# EAGLE design DAQ (EAGLE 7.3.0)
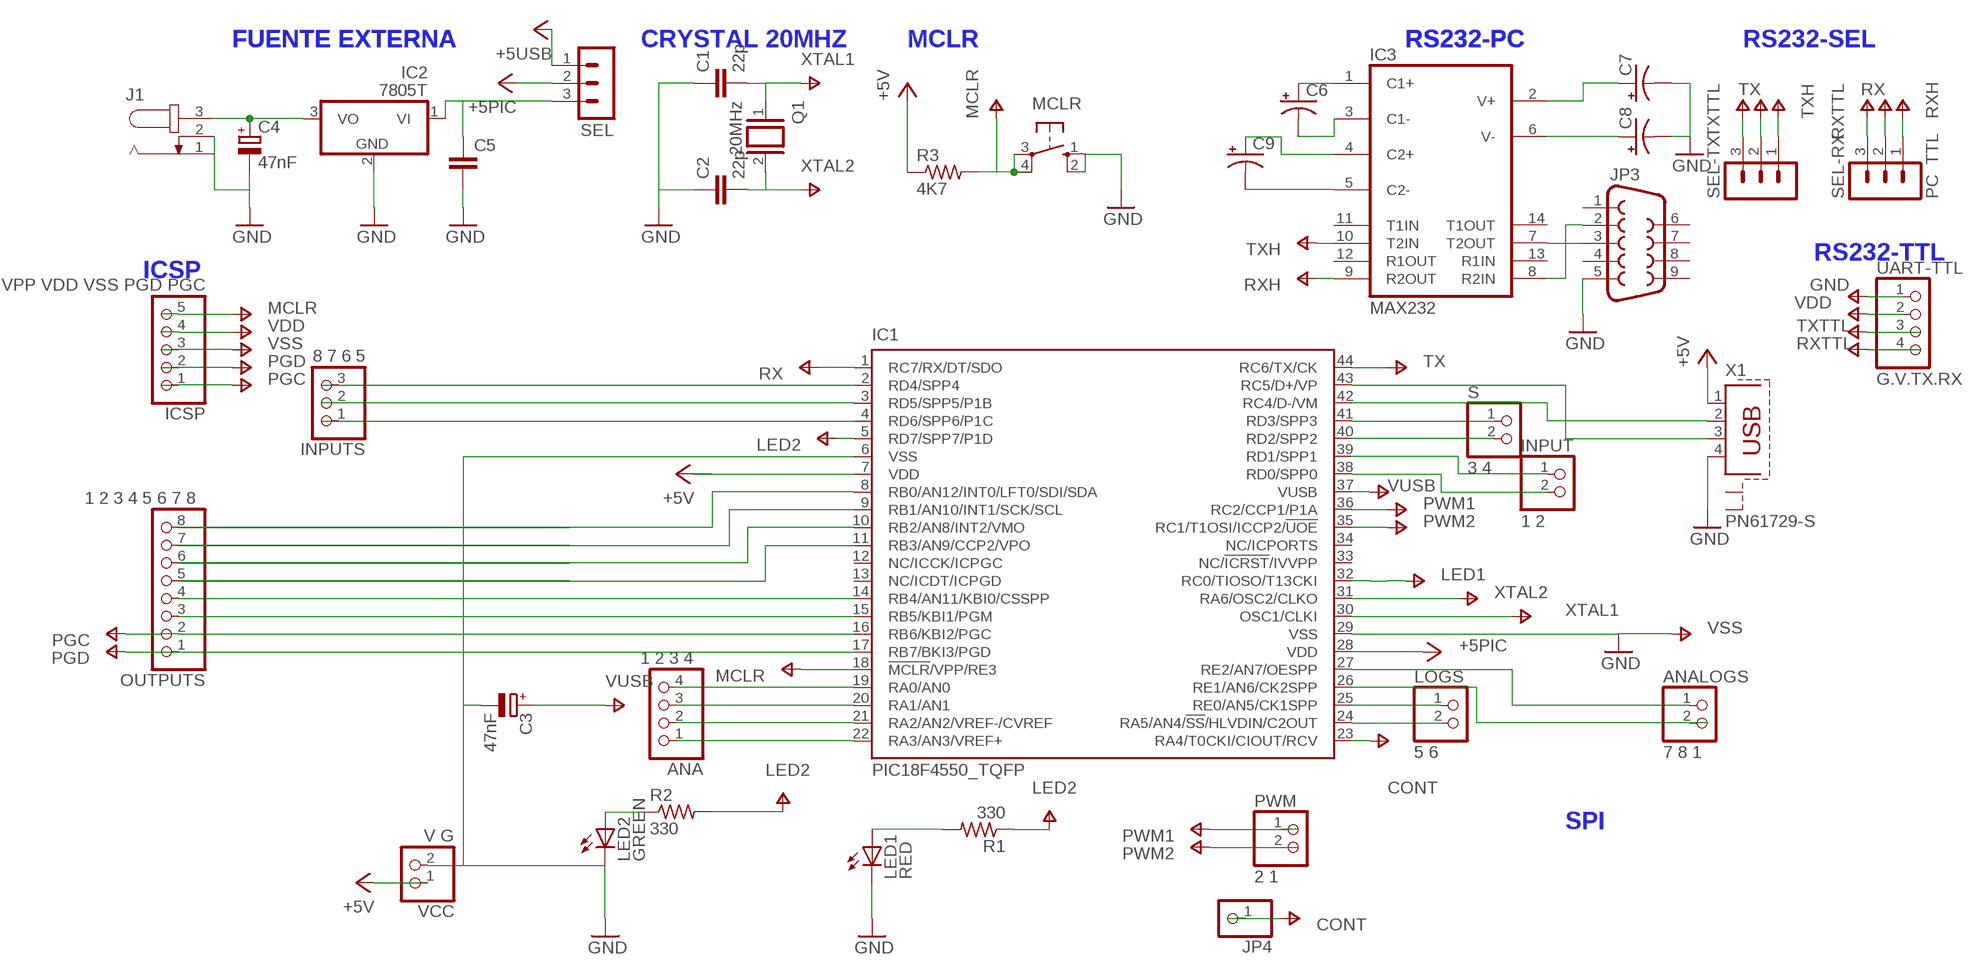
[diagram p0: schematic, sheet 1]

## Parts
ANA  1 2 3 4  PINHD-1X4  [1X04]
ANALOGS  7 8 1  PINHD-1X2  [1X02]
C1  22p  C-EU025-024X044  [C025-024X044]
C2  22p  C-EU025-024X044  [C025-024X044]
C3  47nF  CPOL-EUE2,5-6E  [E2,5-6E]
C4  47nF  CPOL-EUE2,5-6E  [E2,5-6E]
C5  C-EU050-035X075  [C050-035X075]
C6  CPOL-USE2.5-6  [E2,5-6]
C7  CPOL-USE2.5-6  [E2,5-6]
C8  CPOL-USE2.5-6  [E2,5-6]
C9  CPOL-USE2.5-6  [E2,5-6]
IC1  PIC18F4550_TQFP  [TQFP44]
IC2  7805T  [TO220H]
IC3  MAX232  [DIL16]
ICSP  VPP VDD VSS PGD PGC  PINHD-1X5  [1X05]
INPUT  1 2  PINHD-1X2  [1X02]
INPUTS  8 7 6 5  PINHD-1X3  [1X03]
J1  JACK-PLUG0  [SPC4077]
JP3  DB9MALE  [DB9_MALE]
JP4  PINHD-1X1  [1X01]
LED1  RED  TLLR4400  [LED3MM]
LED2  GREEN  TLLG4400  [LED3MM]
LOGS  5 6  PINHD-1X2  [1X02]
MCLR  10-XX  [B3F-10XX]
OUTPUTS  1 2 3 4 5 6 7 8  PINHD-1X8  [1X08]
PWM  2 1  PINHD-1X2  [1X02]
Q1  20MHz  XTAL/S  [QS]
R1  330  R-US_0207/10  [0207/10]
R2  330  R-US_0207/10  [0207/10]
R3  4K7  R-US_0207/10  [0207/10]
S  3 4  PINHD-1X2  [1X02]
SEL  MA03-1  [MA03-1]
SEL-RX  PC TTL  MA03-1  [MA03-1]
SEL-TX  MA03-1  [MA03-1]
UART-TTL  G.V.TX.RX  PINHD-1X4  [1X04]
VCC  V G  PINHD-1X2  [1X02]
X1  PN61729-S  [PN61729-S]

## Nets
+5PIC: IC1.7(VDD) IC1.28(VDD) ICSP.4 R3.1 SEL.2 UART-TTL.2 VCC.1 ; supply symbol labelled +5V, VDD
+5USB: SEL.1 X1.1 ; supply symbol labelled +5V
CONT: IC1.23(RA4/T0CKI/CIOUT/RCV) JP4.1
GND: C1.1 C2.1 C3.- C4.- C5.2 C7.- C8.- IC1.6(VSS) IC1.29(VSS) IC2.2(GND) ICSP.3 J1.1 J1.2 JP3.5 LED1.K(C) LED2.K(C) MCLR.1(S) MCLR.2(S1) UART-TTL.1 VCC.2 X1.4 ; supply symbol labelled VSS
LED1: IC1.32(RC0/TIOSO/T13CKI) R2.2 ; supply symbol labelled LED2
LED2: IC1.5(RD7/SPP7/P1D) R1.1
MCLR: IC1.18(!MCLR!/VPP/RE3) ICSP.5 MCLR.3(P) MCLR.4(P1) R3.2
N$1: IC1.42(RC4/D-/VM) X1.2
N$2: C7.+ IC3.2(V+)
N$3: C8.+ IC3.6(V-)
N$4: IC1.8(RB0/AN12/INT0/LFT0/SDI/SDA) OUTPUTS.8
N$5: LED2.A R2.1
N$6: C6.+ IC3.1(C1+)
N$7: LED1.A R1.2
N$8: C6.- IC3.3(C1-)
N$9: IC1.15(RB5/KBI1/PGM) OUTPUTS.3
N$10: IC1.14(RB4/AN11/KBI0/CSSPP) OUTPUTS.4
N$11: IC1.11(RB3/AN9/CCP2/VPO) OUTPUTS.5
N$12: IC1.9(RB1/AN10/INT1/SCK/SCL) OUTPUTS.7
N$13: IC1.10(RB2/AN8/INT2/VMO) OUTPUTS.6
N$14: C9.+ IC3.4(C2+)
N$15: IC1.43(RC5/D+/VP) X1.3
N$16: IC1.2(RD4/SPP4) INPUTS.3
N$17: IC1.3(RD5/SPP5/P1B) INPUTS.2
N$18: IC1.4(RD6/SPP6/P1C) INPUTS.1
N$19: IC1.38(RD0/SPP0) INPUT.2
N$20: C9.- IC3.5(C2-)
N$21: IC1.40(RD2/SPP2) S.2
N$22: IC1.41(RD3/SPP3) S.1
N$23: ANA.4 IC1.19(RA0/AN0)
N$24: ANA.3 IC1.20(RA1/AN1)
N$25: ANA.2 IC1.21(RA2/AN2/VREF-/CVREF)
N$26: ANA.1 IC1.22(RA3/AN3/VREF+)
N$27: IC1.24(RA5/AN4/!SS!/HLVDIN/C2OUT) LOGS.2
N$28: IC1.25(RE0/AN5/CK1SPP) LOGS.1
N$29: IC1.39(RD1/SPP1) INPUT.1
N$31: ANALOGS.2 IC1.26(RE1/AN6/CK2SPP)
N$32: ANALOGS.1 IC1.27(RE2/AN7/OESPP)
N$33: IC3.7(T2OUT) JP3.3
N$34: IC3.8(R2IN) JP3.2
N$131: C4.+ IC2.3(VO) J1.3
N$132: C5.1 IC2.1(VI) SEL.3
PGC: IC1.16(RB6/KBI2/PGC) ICSP.1 OUTPUTS.2
PGD: IC1.17(RB7/BKI3/PGD) ICSP.2 OUTPUTS.1
PWM1: IC1.36(RC2/CCP1/P1A) PWM.1
PWM2: IC1.35(RC1/T1OSI/ICCP2/!UOE) PWM.2
RX: IC1.1(RC7/RX/DT/SDO) SEL-RX.2
RXH: IC3.9(R2OUT) SEL-RX.1
RXTTL: SEL-RX.3 UART-TTL.4
TX: IC1.44(RC6/TX/CK) SEL-TX.2
TXH: IC3.10(T2IN) SEL-TX.1
TXTTL: SEL-TX.3 UART-TTL.3
VUSB: C3.+ IC1.37(VUSB)
XTAL1: C1.2 IC1.30(OSC1/CLKI) Q1.1
XTAL2: C2.2 IC1.31(RA6/OSC2/CLKO) Q1.2
Unconnected: IC1.12(NC/ICCK/ICPGC) IC1.13(NC/ICDT/ICPGD) IC1.33(NC/!ICRST!/IVVPP) IC1.34(NC/ICPORTS) IC3.11(T1IN) IC3.12(R1OUT) IC3.13(R1IN) IC3.14(T1OUT) JP3.1 JP3.4 JP3.6 JP3.7 JP3.8 JP3.9 X1.S1 X1.S2

## Notes on the sheet
- FUENTE EXTERNA | FUENTE EXTERNA | CRYSTAL 20MHZ | MCLR | RS232-PC | RS232-PC | RS232-SEL
- RS232-TTL
- ICSP
- SPI

## Power pins joined to a net without a drawn wire
+5PIC: IC3.16(VCC)
GND: IC3.15(GND)

## Library data of the parts
ANA UART-TTL = pinhead:PINHD-1X4: PIN HEADER
ANALOGS INPUT LOGS PWM S VCC = pinhead:PINHD-1X2: PIN HEADER
C1 C2 C5 = rcl:C-EU: CAPACITOR, European symbol
C3 C4 = resistor:CPOL-EU: POLARIZED CAPACITOR, European symbol
C6-C9 = adafruit:CPOL-US: POLARIZED CAPACITOR, American symbol
IC1 = microchip:PIC18F4*_TQFP: USB Microcontrollers with nanoWatt Technology High-Performance, Enhanced Flash, 28/40/44-Pin, Source: http://ww1.microchip.com/downloads/en/devicedoc/39632c.pdf; MF: MICROCHIP; MPN: PIC18F4550-I/PT; OC_FARNELL: 9321365; OC_NEWARK: 08J9633
IC2 = linear:78*: Positive VOLTAGE REGULATOR Source: http://cache.national.com/ds/LM/LM78L05.pdf http://www.fairchildsemi.com/ds/LM/LM7805.pdf
IC3 = maxim:MAX232: RS232 TRANSCEIVER; MF: MAXIM; MPN: MAX232ACPE+; OC_FARNELL: 9723773; OC_NEWARK: 68K4544
ICSP = pinhead:PINHD-1X5: PIN HEADER
INPUTS = pinhead:PINHD-1X3: PIN HEADER
J1 = con-jack:JACK-PLUG: DC POWER JACK Power Jack, DC, Right Angle, Through Hole, Rated 5A at 16VDC, PC Terminals Distributor: Farnell (www.Farnell.de) Drawing: 84N1161.pdf / 84N1162.pdf Manufacturer: SPC Technology (www.spctechnology.com) Type: SPC4077 / SPC 4078; OC_FARNELL: unknown; OC_NEWARK: unknown
JP3 = SparkFun-Connectors:DB9: DB9 Connector Standard DB9 (D-Sub 9) serial connector. Can be used for CAN bus as well as RS485 and RS232. Footprint production proven. Spark Fun Electronics SKU : PRT-00429; PROD_ID: CONN-09904
JP4 = pinhead:PINHD-1X1: PIN HEADER
LED1 = led:TLLR4400: Low Current (2mA) LED 3 mm Tinted Diffused Package color RED Source: Data sheet <http://www.farnell.com/datasheets/391100.pdf>; MF: VISHAY SEMICONDUCTOR; OC_FARNELL: 1612437
LED2 = led:TLLG4400: Low Current (2mA) LED 3 mm Tinted Diffused Package color GREEN Source: Data sheet <http://www.farnell.com/datasheets/391098.pdf>; MF: VISHAY SEMICONDUCTOR; OC_FARNELL: 1612435
MCLR = switch-omron:10-XX: OMRON SWITCH; MPN: B3F-1000; OC_FARNELL: 176432; OC_NEWARK: 36M3542
OUTPUTS = pinhead:PINHD-1X8: PIN HEADER
Q1 = special:XTAL/S: CRYSTAL
R1-R3 = resistor:R-US_: RESISTOR, American symbol
SEL SEL-RX SEL-TX = con-lstb:MA03-1: PIN HEADER; OC_FARNELL: unknown; OC_NEWARK: unknown
X1 = con-berg:PN61729-S: BERG USB connector; OC_FARNELL: unknown; OC_NEWARK: unknown

## Board
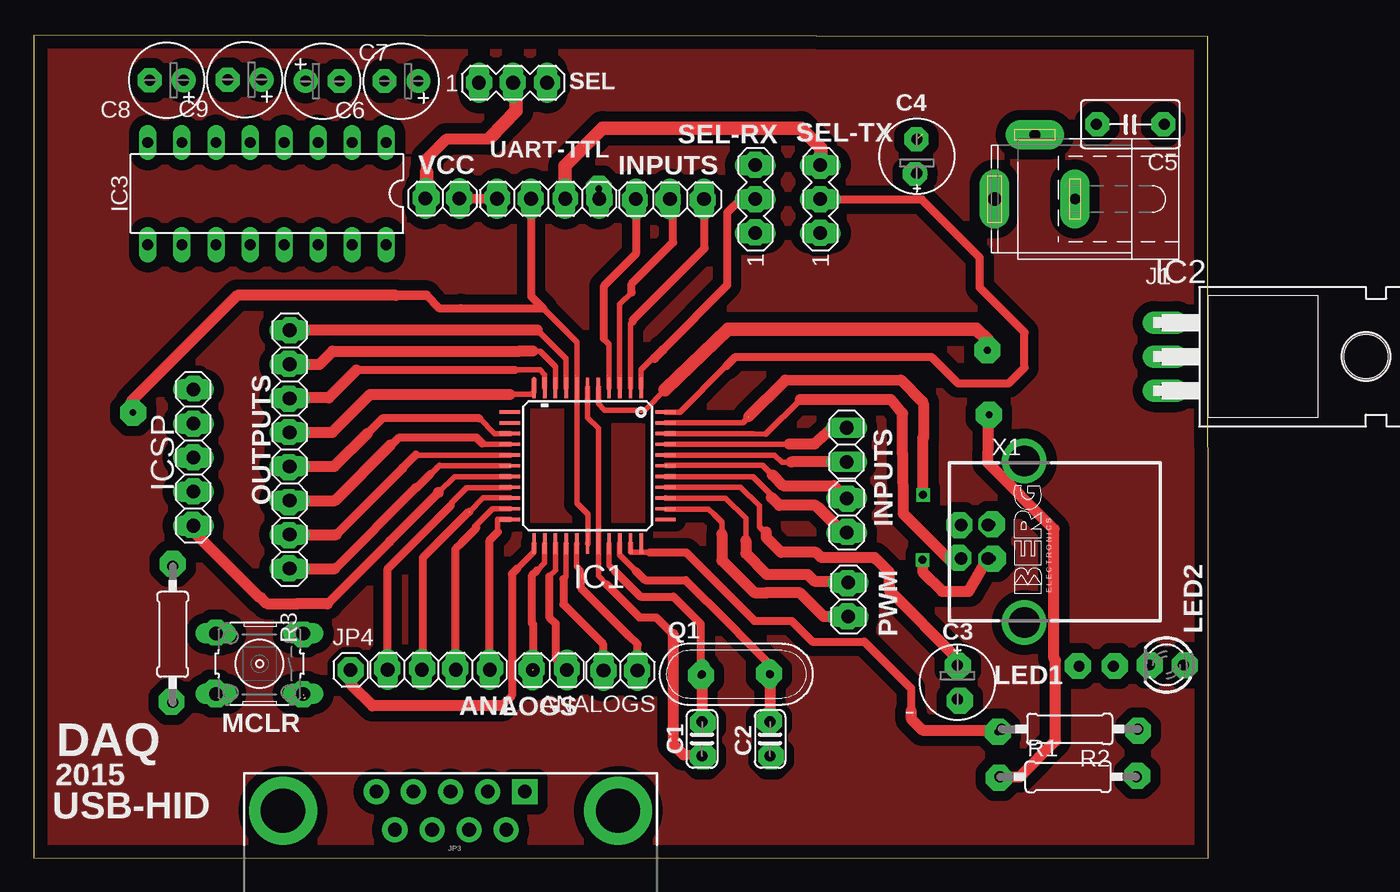
[diagram p1: board, top side]
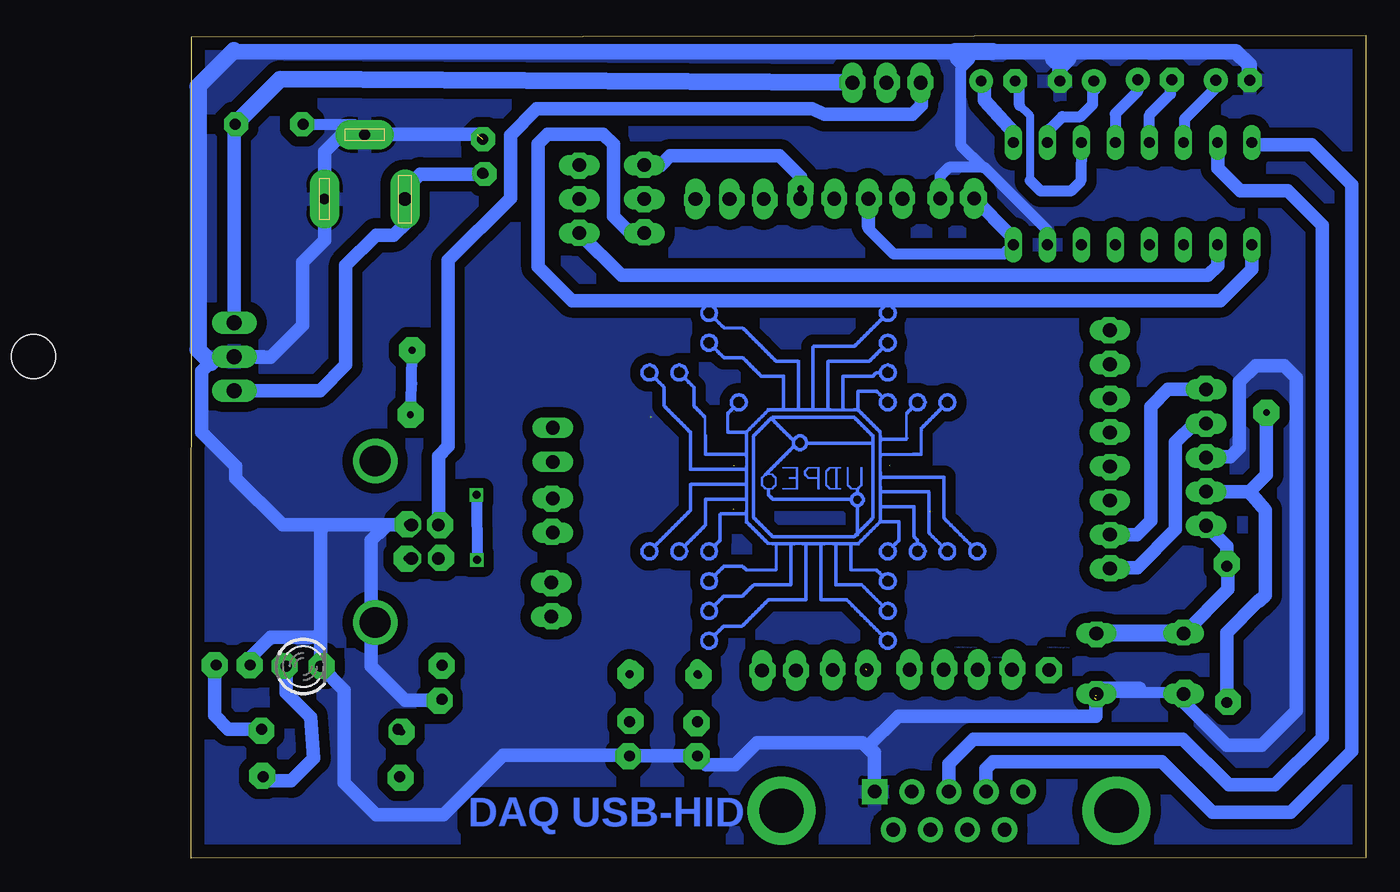
[diagram p2: board, bottom side, seen from below]

Size 87.65 x 61.35 mm. Coordinates in mm from the lower left corner, seen from the top.
Outline: 0.01,0.05 87.65,0 87.59,61.25 0,61.35 0.01,0.05
Copper layers (1*16): Top 0.035mm / dielectric 1.5mm / Bottom 0.035mm
Design rules "default *": minimum track width 10mil, minimum drill 24mil, track to track 30mil, track to pad 30mil, pad to pad 30mil, via to via 30mil, smd to smd 30mil, copper to edge 40mil, drill to drill 8mil, minimum pad ring 10mil, minimum via ring 8mil, stop-mask expansion 4mil, vias tented up to drill 0mil, thermal gap 10mil

### Footprints (pad centres in the part's own frame; a part is rotated, then mirrored left to right if it is on the bottom)
1X04 = drill 1.016 long: 1 -3.81,0; 2 -1.27,0; 3 1.27,0; 4 3.81,0
1X02 = drill 1.016 long: 1 -1.27,0; 2 1.27,0
C025-024X044 = drill 0.813 octagon: 1 -1.27,0; 2 1.27,0
E2,5-6E = drill 0.813 pad 1.575: + -1.27,0 | drill 0.813 pad 1.575 octagon: - 1.27,0
C050-035X075 = drill 0.813 octagon: 1 -2.54,0; 2 2.54,0
E2,5-6 = drill 0.813 pad 1.778: + -1.27,0 | drill 0.813 pad 1.778 octagon: - 1.27,0
TQFP44 = smd 1.5 x 0.246: 1 -5.8,4; 2 -5.8,3.2; 3 -5.8,2.4; 4 -5.8,1.6; 5 -5.8,0.8; 6 -5.8,0; 7 -5.8,-0.8; 8 -5.8,-1.6; 9 -5.8,-2.4; 10 -5.8,-3.2; 11 -5.8,-4; 23 5.8,-4; 24 5.8,-3.2; 25 5.8,-2.4; 26 5.8,-1.6; 27 5.8,-0.8; 28 5.8,0; 29 5.8,0.8; 30 5.8,1.6; 31 5.8,2.4; 32 5.8,3.2; 33 5.8,4 | smd 0.246 x 1.5: 12 -4,-5.8; 13 -3.2,-5.8; 14 -2.4,-5.8; 15 -1.6,-5.8; 16 -0.8,-5.8; 17 0,-5.8; 18 0.8,-5.8; 19 1.6,-5.8; 20 2.4,-5.8; 21 3.2,-5.8; 22 4,-5.8; 34 4,5.8; 35 3.2,5.8; 36 2.4,5.8; 37 1.6,5.8; 38 0.8,5.8; 39 0,5.8; 40 -0.8,5.8; 41 -1.6,5.8; 42 -2.4,5.8; 43 -3.2,5.8; 44 -4,5.8
TO220H = drill 1.118 long: 1 -2.54,-10.16; 2 0,-10.16; 3 2.54,-10.16 | hole 3.302: 0,4.826
DIL16 = drill 0.813 long: 1 -8.89,-3.81; 2 -6.35,-3.81; 3 -3.81,-3.81; 4 -1.27,-3.81; 5 1.27,-3.81; 6 3.81,-3.81; 7 6.35,-3.81; 8 8.89,-3.81; 9 8.89,3.81; 10 6.35,3.81; 11 3.81,3.81; 12 1.27,3.81; 13 -1.27,3.81; 14 -3.81,3.81; 15 -6.35,3.81; 16 -8.89,3.81
1X05 = drill 1.016 long: 1 -5.08,0; 2 -2.54,0; 3 0,0; 4 2.54,0; 5 5.08,0
1X03 = drill 1.016 long: 1 -2.54,0; 2 0,0; 3 2.54,0
SPC4077 = drill 0.8 pad 2.184 long: 1 -3,0; 2 0,-4.8 | drill 1 pad 2.184 long: 3 3,0
DB9_MALE = drill 1.016 pad 1.88: 1 5.54,-1.42; 2 2.77,-1.42; 3 0,-1.42; 4 -2.77,-1.42; 6 4.15,1.42; 7 1.38,1.42; 8 -1.38,1.42; 9 -4.15,1.42 | drill 1.016 pad 1.88 square: 5 -5.54,-1.42 | drill 3.302 pad 5.08: G1 -12.5,0; G2 12.5,0
1X01 = drill 1.016 octagon: 1 0,0
LED3MM = drill 0.813 octagon: A -1.27,0; K 1.27,0
B3F-10XX = drill 1.016 long: 1 -3.251,2.261; 2 3.251,2.261; 3 -3.251,-2.261; 4 3.251,-2.261
1X08 = drill 1.016 long: 1 -8.89,0; 2 -6.35,0; 3 -3.81,0; 4 -1.27,0; 5 1.27,0; 6 3.81,0; 7 6.35,0; 8 8.89,0
QS = drill 0.61 long: 1 -2.54,0; 2 2.54,0
0207/10 = drill 0.813 octagon: 1 -5.08,0; 2 5.08,0
MA03-1 = drill 1.016 long: 1 -2.54,0; 2 0,0; 3 2.54,0
PN61729-S = drill 0.95 octagon: 1 1.25,4.71; 2 -1.25,4.71; 3 -1.25,2.71; 4 1.25,2.71 | drill 2.3 pad 2.9: S1 -6.02,0; S2 6.02,0

### Placement (x,y rotation side)
ANA  30.23,14.06 180 top
ANALOGS  43.79,14 180 top
C1  49.87,8.9 90 top
C2  54.95,8.9 90 top
C3  68.92,13.11 270 top
C4  65.89,52.36 90 top
C5  81.82,54.73 180 top
C6  27.44,57.96 180 top
C7  21.57,57.96 0 top
C8  9.94,58.01 180 top
C9  15.75,58.06 180 top
IC1  41.33,29.27 270 top
IC2  94.57,37.41 270 top
IC3  17.42,49.56 180 top
ICSP  11.92,29.88 270 top
INPUT  60.66,25.56 270 top
INPUTS  47.48,49.16 0 top
J1  74.7,49.16 180 top
JP3  31.11,3.55 180 top
JP4  23.65,14.05 0 top
LED1  79.27,14.31 0 bottom
LED2  84.51,14.41 180 top
LOGS  38.51,14.03 180 top
MCLR  16.86,14.51 180 top
OUTPUTS  19.11,30.49 90 top
PWM  60.78,19.29 270 top
Q1  52.41,13.72 0 top
R1  77.17,6.08 0 top
R2  77.3,9.63 180 top
R3  10.38,16.7 90 top
S  60.65,30.83 270 top
SEL  35.77,57.83 0 top
SEL-RX  53.84,49.16 90 top
SEL-TX  58.69,49.16 90 top
UART-TTL  38.39,49.18 0 top
VCC  30.5,49.2 0 top
X1  73.91,23.6 90 top

### Tracks (layer width: path | path; a pad name or v marks a point on that pad's centre or on a via)
+5PIC  (via drill 0.5 pad 1.93)
  Top 0.406: IC1.28 41.36,23.49 41.36,25.66 40.53,26.49 IC1.7 40.53,38.48 38.03,40.98 | 31.86,41.13 31.71,40.98
  Top 0.61: 29.32,41.97 30.31,40.98 31.71,40.98 38.03,40.98 37.12,41.89 UART-TTL.2 | 29.22,49.18 VCC.1
  Top 0.711: 29.32,41.97 27.03,41.97 | 29.27,49.16 VCC.1
  Top 0.813: 27.03,41.97 15.2,41.97 7.3,34.07 7.3,33.36 v7.42,33.23 | 29.32,51.16 29.32,52.15 30.82,53.65 33.97,53.65 34.04,53.73
  Top 1.016: v29.32,49.28 29.32,51.16 | 34.04,53.73 36,55.73 35.95,57.65 SEL.2
  Bottom 0.711: v29.32,49.28 VCC.1
  Bottom 0.813: 37.12,47.17 37.12,46.95 35.24,45.07 26.99,45.07 IC3.16
  Bottom 1.016: 26.31,46.02 IC3.16 26.36,46.32 v29.32,49.28 | v7.42,33.23 7.42,28.61 8.69,27.34 | 8.69,27.34 ICSP.4 | R3.1 10.38,16.83 8.06,19.16 7.98,19.16 7.53,19.62 7.53,25.97 8.69,27.34 | 37.12,47.17 UART-TTL.2
+5USB
  Bottom 1.016: X1.1 69.2,29.98 68.46,30.72 68.46,44.58 63.81,49.23 63.81,53.93 61.86,55.89 41.33,55.89 40.39,55.48 33.84,55.48 33.18,56.14 33.13,57.73 SEL.1
CONT
  Top 0.406: IC1.23 37.33,22.85 36.08,21.6
  Top 0.61: 36.08,21.6 35.69,21.22 35.69,12.12 34.93,11.36
  Top 0.813: 34.93,11.36 25.28,11.36 23.71,12.94 23.71,14 JP4.1
GND  (via drill 0.5 pad 1.93)  (3 unrouted)
  Top 0.406: IC1.6 41.33,32.85 42.13,32.05 IC1.29 42.13,21.05 42.78,20.4
  Top 0.61: 42.78,20.4 42.78,20.38 45.19,17.96 46.44,17.96 47.71,16.69
  Top 0.711: 48.5,7.7 49.79,7.7 C1.1 | VCC.2 34.56,49.19 UART-TTL.1
  Top 0.813: v13.51,12.35 MCLR.2 | 20.19,12.17 MCLR.1 | 47.71,16.69 47.71,8.49 48.5,7.7
  Bottom 0.61: 55,7.68 C2.1
  Bottom 0.813: MCLR.1 19.99,12.37 17.17,12.37 16.81,12.74 19.89,12.74 20.25,12.37 13.73,12.37 MCLR.2 | C5.2 75.47,54.73 J1.2 | 23.77,46.45 23.77,46.83 28.46,51.52 28.58,51.52 | 28.58,51.52 31.12,51.52 31.78,50.86 31.78,49.21 VCC.2 | 28.58,51.52 30.21,53.14 30.21,58.91 29.55,59.57 29.57,59.57 30.18,58.96 30.18,59.14 30.67,59.62 30.67,60.16 30.66,60.16
  Bottom 1.016: 66.3,53.99 74.66,53.99 J1.2 74.89,53.77 76.6,53.77 77.7,52.67 J1.1 77.7,46.07 79.33,44.43 79.33,39.76 81.72,37.37 82.75,37.37 82.79,37.41 | C7.- 22.84,58.43 | 32.04,49.46 VCC.2 | 23.77,46.45 IC3.15 23.82,46.22 | 72.98,24.85 77.66,24.85 | 77.66,24.85 80.81,24.85 84.31,28.35 84.31,29.24 86.85,31.78 86.85,36.3 86.18,36.98 86.01,37.14 84.68,37.14 IC2.2 82.79,37.41 | 82.79,37.41 82.27,37.41 | 78,16.85 LED1.K 76.23,12.54 76.23,5.62 73.85,3.23 68.82,3.23 64.37,7.68 55,7.68 | 78,16.85 78,24.51 77.66,24.85 | LED2.K 83.19,14.41 83.14,14.46 83.14,15.07 81.72,16.49 78.35,16.49 78,16.85 | 49.61,7.37 C1.1 | C2.1 C1.1 | X1.4 72.98,24.85 | 72.98,24.85 73.57,24.26 73.67,24.26 74.23,23.71 74.23,14.31 71.69,11.77 68.99,11.77 C3.- | v13.51,12.35 13.51,11.55 10.37,8.41 10.35,8.44 7.75,8.44 5.19,11.01 5.19,35.85 6.08,36.74 8.24,36.74 9.46,35.52 9.46,30.61 10.12,29.95 11.84,29.95 ICSP.3 11.13,29.88 | JP3.5 36.65,7.92 36.87,7.92 37.22,8.26 | 20.25,11.97 20.25,12.02 20.1,12.17 20.4,12.17 | 20.15,11.87 20.15,10.6 34.88,10.6 37.22,8.26 | 37.22,8.26 37.57,8.62 45.45,8.62 47.07,6.99 49.23,6.99 C1.1
  Bottom 1.143: 27.85,60.15 22.87,60.15 | 22.87,60.15 9.71,60.15 8.72,59.16 8.72,58.06 C8.- | 22.84,58.43 22.84,58.99 22.18,59.65 22.23,59.65 22.82,59.06 23.35,59.6 23.35,59.67 22.87,60.15 | 30.66,60.16 84.39,60.16 84.46,60.23
  Bottom 1.27: 27.85,60.15 30.66,60.16 | 84.46,60.23 87.13,57.56 87.13,37.93 86.18,36.98
  pour Bottom: -0.48,61.96 -0.58,-0.63 89.03,-0.63 88.98,62.26 -0.63,62.26
LED1
  Top 0.406: IC1.32 44.53,22.84 44.56,22.82 45.96,22.82
  Top 0.61: 45.96,22.82 48.67,22.82 53.78,17.71 56.55,17.71 58.1,16.16 61.98,16.16 65.46,12.68 65.46,10.98
  Top 0.813: 65.46,10.98 65.46,10.42 66.33,9.56 72.14,9.56 R2.2
LED2  (via drill 0.5 pad 1.93)
  Top 0.406: IC1.5 42.13,33.88 42.6,33.41 45.6,33.41 47.12,34.93
  Top 0.61: 71.13,38.69 71.13,37.9 v71.15,37.88
  Top 0.813: v71.28,33.08 71.18,29.5 76.13,24.54 76.13,14.87 76.23,14.76 76.23,8.74 73.57,6.08 R1.1 | v71.15,37.88 71.13,38.01
  Top 1.016: 47.12,34.93 51.8,39.45 70.34,39.45 71.1,38.69 71.13,38.69
  Bottom 0.813: v71.28,33.08 71.18,35.39 v71.15,37.88
MCLR
  Top 0.406: IC1.18 31.4,28.47 30.22,27.28
  Top 0.711: 30.21,27.28 26.56,23.63 26.56,23.6 21.93,18.97
  Top 0.813: 30.22,27.28 30.21,27.28 | 21.93,18.97 19.7,18.97 19.69,18.98 17.41,18.98 16.95,19.44 16.87,19.44 11.92,24.39 ICSP.5
  Bottom 1.016: ICSP.5 10.38,23.26 R3.2 10.29,21.69 10.29,20.07 13.53,16.83 13.53,16.77 MCLR.3
  Bottom 1.27: MCLR.4 MCLR.3
N$1  (via drill 0.6)
  Top 0.406: IC1.42 53.72,31.67 54.62,31.63 57.2,34.21
  Top 0.813: v69.21,22.37 68.22,22.37 64.87,25.72 64.83,30.13 64.83,33.15 63.95,34.2 59.15,34.21 57.2,34.21
  Bottom 0.406: X1.2 v69.21,22.37
N$2
  Bottom 0.813: 23.55,52.89 23.55,53.12 | 23.55,53.12 23.55,54.41 22.66,55.3 21.29,55.3 20.38,56.22 20.38,57.28 20.3,57.36 | IC3.2 23.77,53.33 23.55,53.12
  Bottom 1.016: C7.+ 20.3,57.36
N$3
  Bottom 0.813: C8.+ 11.21,57.46 13.55,55.13 13.55,53.23 13.61,53.17
  Bottom 1.016: IC3.6 13.61,53.17
N$4
  Top 0.406: 37.58,39.38 39.73,37.23 IC1.8
  Top 0.813: 37.58,39.38 19.11,39.38 OUTPUTS.8
N$5
  Bottom 1.016: R2.1 84.87,9.63 85.88,10.65 85.88,14.31 LED2.A
N$6
  Bottom 1.016: C6.+ 28.46,57.7 28.46,56.52 26.31,54.12 IC3.1
N$7
  Bottom 1.016: LED1.A 80.54,12.34 78.72,10.52 78.49,7.45 80.17,5.77 81.95,5.77 R1.2
N$8
  Bottom 0.61: 25.05,50.53 25.05,55.35 25.84,56.14
  Bottom 0.813: IC3.3 21.28,50.49 22.03,49.74 24.26,49.74 25.05,50.53 | 25.84,56.14 25.84,57.63 C6.-
N$9
  Top 0.406: IC1.15 33.53,30.87 33.49,30.91
  Top 0.61: 26.64,30.83 26.72,30.83 27.28,31.38 33.02,31.38 33.49,30.91
  Top 0.813: OUTPUTS.3 22.49,26.68 26.64,30.83
N$10
  Top 0.406: IC1.14 34.41,31.67 33.27,32.81
  Top 0.61: 33.27,32.81 26.03,32.81 24.9,31.67
  Top 0.813: OUTPUTS.4 22.44,29.22 24.9,31.67
N$11
  Top 0.406: IC1.11 37.33,35.68 37.34,35.69 37.34,34.8 37.16,34.61 35.54,34.61 35.52,34.59
  Top 0.813: OUTPUTS.5 22.28,31.76 25.12,34.6 35.52,34.6 35.52,34.59
N$12
  Top 0.406: IC1.9 38.93,36.6 38.94,36.6 38.94,36.63 37.77,37.8 37.26,37.8 37.24,37.82
  Top 0.813: OUTPUTS.7 21.33,36.84 22.31,37.81 36.25,37.81 36.26,37.82 37.24,37.82
N$13
  Top 0.406: IC1.10 38.13,36.07 37.78,36.42 35.92,36.42 35.91,36.4
  Top 0.61: 35.91,36.4 24.12,36.4 24.1,36.42
  Top 0.813: 24.1,36.42 22.02,34.33 19.14,34.33 OUTPUTS.6
N$14
  Bottom 0.813: C9.+ 17.03,57.18 18.7,55.51 18.7,52.62 IC3.4
N$15  (via drill 0.6)  (1 unrouted)
  Top 0.406: IC1.43 52.92,32.47 53.35,32.9
  Top 0.813: v66.31,22.26 66.31,21.38 67.8,19.9 69.77,19.9 X1.3 | v66.35,27.1 66.35,31.25 | 66.35,31.25 66.35,31.43 | 53.35,32.93 56.09,35.66 64.69,35.68 66.31,34.04 66.31,33.98 66.38,33.92 66.38,31.27 66.35,31.25
  Bottom 0.813: v66.35,27.1 v66.31,22.26
N$16
  Top 0.406: 44.71,40.04 44.53,39.86 IC1.2
  Top 0.61: 44.71,40.04 44.71,40.14 50.07,45.5 50.07,49.11 INPUTS.3
N$17
  Top 0.406: IC1.3 43.73,41.29 44.61,42.17
  Top 0.61: INPUTS.2 47.45,48.65 47.71,48.39 47.71,45.93 44.61,42.83 44.61,42.17
N$18
  Top 0.406: IC1.4 42.93,38.34 42.53,38.74
  Top 0.61: INPUTS.1 44.94,45.07 42.53,42.65 42.53,38.74
N$19
  Top 0.406: IC1.38 53.65,28.47 55.04,27.08 | 55.04,26.92 55.04,27.08 | 55.04,27.08 55.71,26.41 58.35,26.41 58.44,26.32 58.66,26.32 60.73,24.25
  Top 0.813: INPUT.2 60.65,24.3 60.36,24.3 58.34,26.32 55.63,26.32 55.04,26.92
N$20
  Bottom 0.813: 16.15,53.21 16.15,55.44 14.59,57 14.59,57.96 C9.-
  Bottom 1.016: IC3.5 16.15,53.21
N$21
  Top 0.406: 56.54,29.53 55.82,29.53 55.29,30.07 IC1.40 | IC1.40
  Top 0.813: S.2 56.56,29.56 56.54,29.53
N$22
  Top 0.406: IC1.41 56.05,30.87 56.37,30.89
  Top 0.813: 56.37,30.89 58.26,30.89 59.43,31.96 60.52,31.97 S.1
N$23
  Top 0.406: 31.15,26.32 31.15,26.47 32.32,27.64 35.51,27.64 IC1.19
  Top 0.61: ANA.4 26.42,21.59 31.15,26.32
  Top 0.711: 26.4,14.08 ANA.4
N$24  (1 unrouted)
  Top 0.406: IC1.20 33.55,26.87 32.52,25.84
  Top 0.61: 32.49,25.84 32.47,25.84 29.04,22.41 29.04,14.14 ANA.3
  Top 0.813: 29.09,15.02 29.16,14.95 28.81,14.21 ANA.3
N$25
  Top 0.406: 33.05,24.65 33.05,24.67 32.91,24.53 32.91,24.73 34.23,26.06 IC1.21
  Top 0.61: 33.05,24.65 32.11,23.71 31.92,23.52 31.5,23.1 ANA.2
N$26
  Top 0.406: IC1.22 35.53,25.28 34.63,25.28 34.63,24.31
  Top 0.61: ANA.1 34.04,23.73 34.63,24.31
N$27  (2 unrouted)
  Top 0.406: IC1.24 38.13,22.03 37.55,21.44
  Top 0.61: 37.55,21.44 37.17,21.06 37.17,17.56 37.29,17.43 37.29,14.08
N$28
  Top 0.406: IC1.25 38.93,21.48 38.46,21.01
  Top 0.61: 38.46,21.01 38.46,17.99 38.95,17.51 38.95,14.87 LOGS.1
N$29  (1 unrouted)
  Top 0.406: 55.1,28.58 54.38,29.31 47.17,29.31
  Top 0.813: 55.1,28.58 55.13,28.58 55.93,27.78 59.71,27.78 INPUT.1
N$30
  pour Bottom: -0.63,61.4 -0.78,61.4 -0.78,-0.48 88.37,-0.48 88.37,62.11 -0.68,62.11 -0.68,61.5
N$31
  Top 0.406: IC1.26 39.73,21.04 39.53,20.84
  Top 0.61: 39.53,20.84 39.53,18.93 42.48,15.98 42.48,14.04 ANALOGS.2
N$32
  Top 0.406: 40.85,20.89 40.85,21.44 40.52,21.77 IC1.27
  Top 0.61: 40.85,20.89 40.85,20.15 44.32,16.68 44.43,16.57 45.06,15.94 ANALOGS.1
N$33
  Bottom 1.016: IC3.7 11.07,51.45 9.38,49.77 5.82,49.77 3.26,47.2 3.26,9 6.79,5.47 10.24,5.47 13.65,8.87 29.29,8.87 31.11,7.06 JP3.3
N$34
  Bottom 1.016: IC3.8 8.38,53.22 4.05,53.22 1.05,50.22 1.05,7.98 5.6,3.44 11.46,3.44 15.22,7.2 27.82,7.2 28.34,6.68 JP3.2
N$35
  pour Top: 0.03,-0.22 88.55,-0.7 88.09,60.97 0.59,61.25 0.51,60.69
N$36  (via drill 0.5 pad 1.93)
  other vias: 69.07,24.85
N$37  (via drill 0.5 pad 1.93)
  other vias: 71.5,24.91
N$38  (via drill 0.5 pad 1.93)
  other vias: 69.01,22.4
N$39  (via drill 0.5 pad 1.93)
  other vias: 71.56,22.35
N$40  (via drill 0.5 pad 1.93)
  other vias: 23.65,14.03
N$41  (via drill 0.5 pad 1.93)
  other vias: 42.53,13.98
N$42  (via drill 0.5 pad 1.93)
  other vias: 45.02,13.98
N$43  (via drill 0.5 pad 1.93)
  other vias: 34.6,49.23
N$44  (via drill 0.5 pad 1.93)
  other vias: 37.09,49.18
N$45  (via drill 0.5 pad 1.93)
  other vias: 53.85,49.16
N$46  (via drill 0.5 pad 1.93)
  other vias: 53.83,51.72
N$47  (via drill 0.5 pad 1.93)
  other vias: 58.68,49.13
N$48  (via drill 0.5 pad 1.93)
  other vias: 58.68,51.65
N$49  (via drill 0.5 pad 1.93)
  other vias: 53.83,46.69
N$50  (via drill 0.5 pad 1.93)
  other vias: 58.68,46.64
N$51  (via drill 0.5 pad 1.93)
  other vias: 35.74,57.87
N$52  (via drill 0.5 pad 1.93)
  other vias: 38.31,57.84
N$53  (via drill 0.5 pad 1.93)
  other vias: 33.23,57.84
N$54  (via drill 0.5 pad 1.93)
  other vias: 11.97,35.03
N$55  (via drill 0.5 pad 1.93)
  other vias: 11.92,32.39
N$56  (via drill 0.5 pad 1.93)
  other vias: 11.92,29.9
N$57  (via drill 0.5 pad 1.93)
  other vias: 11.92,27.36
N$58  (via drill 0.5 pad 1.93)
  other vias: 11.87,24.87
N$59  (via drill 0.5 pad 1.93)
  other vias: 49.91,49.09
N$60  (via drill 0.5 pad 1.93)
  other vias: 47.32,49.12
N$61  (via drill 0.5 pad 1.93)
  other vias: 44.85,49.07
N$62  (via drill 0.5 pad 1.93)
  other vias: 42.23,49.12
N$63  (via drill 0.5 pad 1.93)
  other vias: 39.67,49.19
N$64  (via drill 0.5 pad 1.93)
  other vias: 19.15,39.37
N$65  (via drill 0.5 pad 1.93)
  other vias: 19.06,36.87
N$66  (via drill 0.5 pad 1.93)
  other vias: 19.06,34.25
N$67  (via drill 0.5 pad 1.93)
  other vias: 19.06,31.79
N$68  (via drill 0.5 pad 1.93)
  other vias: 19.06,29.17
N$69  (via drill 0.5 pad 1.93)
  other vias: 19.06,26.55
N$70  (via drill 0.5 pad 1.93)
  other vias: 19.06,24.09
N$71  (via drill 0.5 pad 1.93)
  other vias: 19.06,21.63
N$72  (via drill 0.5 pad 1.93)
  other vias: 26.37,14.17
N$73  (via drill 0.5 pad 1.93)
  other vias: 28.99,14.17
N$74  (via drill 0.5 pad 1.93)
  other vias: 31.45,14.17
N$75  (via drill 0.5 pad 1.93)
  other vias: 34.07,14.17
N$76  (via drill 0.5 pad 1.93)
  other vias: 37.16,14.13
N$77  (via drill 0.5 pad 1.93)
  other vias: 39.78,14.13
N$81  (via drill 0.5 pad 1.93)
  other vias: 49.79,13.62
N$82  (via drill 0.5 pad 1.93)
  other vias: 54.87,13.78
N$83  (via drill 0.5 pad 1.93)
  other vias: 49.95,10.08
N$84  (via drill 0.5 pad 1.93)
  other vias: 49.95,7.62
N$85  (via drill 0.5 pad 1.93)
  other vias: 55.03,7.62
N$86  (via drill 0.5 pad 1.93)
  other vias: 54.87,10.23
N$87  (via drill 0.5 pad 1.93)
  other vias: 60.72,18.04
N$88  (via drill 0.5 pad 1.93)
  other vias: 60.72,20.51
N$89  (via drill 0.5 pad 1.93)
  other vias: 60.71,24.34
N$90  (via drill 0.5 pad 1.93)
  other vias: 60.71,26.8
N$91  (via drill 0.5 pad 1.93)
  other vias: 68.94,14.36
N$92  (via drill 0.5 pad 1.93)
  other vias: 69.1,11.74
N$93  (via drill 0.5 pad 1.93)
  other vias: 72.01,6
N$94  (via drill 0.5 pad 1.93)
  other vias: 82.4,9.5
N$95  (via drill 0.5 pad 1.93)
  other vias: 85.88,14.39
N$96  (via drill 0.5 pad 1.93)
  other vias: 83.26,14.39
N$97  (via drill 0.5 pad 1.93)
  other vias: 82.33,6.15
N$98  (via drill 0.5 pad 1.93)
  other vias: 71.94,9.42
N$99  (via drill 0.5 pad 1.93)
  other vias: 13.63,16.84
N$100  (via drill 0.5 pad 1.93)
  other vias: 13.63,12.22
N$101  (via drill 0.5 pad 1.93)
  other vias: 20.1,12.22
N$102  (via drill 0.5 pad 1.93)
  other vias: 20.1,16.69
N$103  (via drill 0.5 pad 1.93)
  other vias: 80.67,14.34
N$104  (via drill 0.5 pad 1.93)
  other vias: 77.9,14.34
N$105  (via drill 0.5 pad 1.93)
  other vias: 10.38,21.95
N$106  (via drill 0.5 pad 1.93)
  other vias: 10.29,11.67
N$127  (via drill 1.1 pad 1.78)
  other vias: 73.89,29.61
N$128  (via drill 1.1 pad 1.78)
  other vias: 73.89,17.61
N$129  (via drill 0.5 pad 1.93)
  other vias: 29.25,49.24
N$130  (via drill 0.5 pad 1.93)
  other vias: 31.75,49.24
N$131
  Bottom 1.016: 71.21,49.64 J1.3 | J1.3 71.65,49.11 71.58,47.41 72.53,46.46 73.85,46.46 76.11,44.2 76.11,36.79 78.02,34.87 IC2.3 | J1.3 71.7,49.87 70.54,51.02 65.92,51.02 65.92,51.06 C4.+
N$132
  Bottom 0.813: C5.1 83.98,54.73
  Bottom 1.016: IC2.1 84.41,54.68 C5.1
  Bottom 1.27: SEL.3 81.01,58.08 C5.1
N$133  (via drill 0.6 pad 1.78)
  other vias: 65.74,51.02
N$134  (via drill 0.6 pad 1.78)
  other vias: 65.86,53.61
N$135  (via drill 0.6 pad 1.78)
  other vias: 84.27,54.73
N$136  (via drill 0.6 pad 1.78)
  other vias: 79.36,54.73
PGC
  Top 0.406: IC1.16 28.56,30.07 28.53,30.1
  Top 0.61: 27.52,29.08 27.52,29.11 28.43,30.01 28.44,30.01 28.53,30.1
  Top 0.711: 22.58,24.14 27.52,29.08
  Top 0.813: OUTPUTS.2 22.58,24.14
  Bottom 1.016: OUTPUTS.2 17.1,24.14 16.06,25.18 16.06,33.69 14.79,34.96 ICSP.1
PGD  (1 unrouted)
  Top 0.406: 29.6,28.65 29.63,28.65 30.28,29.3 30.3,29.27 IC1.17
  Top 0.61: 28.52,27.63 28.58,27.63 29.6,28.65
  Top 0.711: 22.48,21.6 28.52,27.63
  Top 0.813: 22.48,21.6 OUTPUTS.1 18.98,21.72
  Bottom 1.016: ICSP.2 12.81,32.42 14.21,31.02 14.21,24.52 17.05,21.67 19.03,21.67 OUTPUTS.1
PWM1
  Top 0.406: IC1.36 47.15,26.85 51.63,26.85 53.13,25.36 53.13,23.68
  Top 0.813: 53.13,23.68 53.13,22.73 54.69,21.17 57.74,21.17 58.25,20.66 60.68,20.66 PWM.1
  Bottom 1.016: 61.54,20.56 PWM.1
PWM2  (1 unrouted)
  Top 0.406: 47.17,26.03 50.36,26.03 50.74,25.65 50.76,25.65 51.35,25.05 51.35,24.16
  Top 0.813: PWM.2 58.96,18.02 57.18,19.79 54.71,19.79 54.69,19.81 53.77,19.81 51.35,22.22 51.35,24.16
RX
  Top 0.406: 46.31,37.29 46.18,37.29 45.33,36.44 IC1.1
  Top 0.61: 53.37,49.16 52.76,49.16 51.75,48.14 51.75,42.73 46.95,37.93
  Top 0.711: SEL-RX.2 53.37,49.16 | 46.95,37.93 46.31,37.29
RXH
  Bottom 1.016: SEL-RX.1 53.89,46.67 54.95,46.67 56.14,47.86 56.14,53.25 56.9,54.01 61.04,54.01 61.75,53.3 61.75,44.1 59.24,41.59 10.85,41.59 8.53,43.91 IC3.9
RXTTL  (via drill 0.5 pad 1.93)
  Top 0.711: v42.17,49.92 42.17,49.21 UART-TTL.4
  Bottom 1.016: v42.17,49.92 42.17,50.81 43.75,52.38 51.9,52.38 52.59,51.7 SEL-RX.3
TX  (1 unrouted)
  Top 0.406: 51.67,36.71 48.22,33.26 IC1.44
  Top 0.61: 51.67,36.71 51.7,36.71 52.38,37.4 66.99,37.4 68.97,35.41 72.75,35.41 73.92,36.58 73.92,39.22 70.59,42.55 70.59,44.79 66.28,49.11 58.74,49.11 SEL-TX.2
TXH
  Bottom 1.016: SEL-TX.1 55.55,43.47 11.79,43.47 11.07,44.19 IC3.10
TXTTL
  Top 0.711: UART-TTL.3 39.66,49.69
  Top 1.016: 39.66,49.69 39.66,51.65 42.45,54.44 57.23,54.44 58.73,52.94 58.73,51.73 SEL-TX.3
VUSB
  Top 0.406: IC1.37 52.75,27.67 54.15,26.27 54.15,24.73 54.57,24.31 54.66,24.31
  Top 0.813: C3.+ 68.92,14.89 63.88,19.93 63.81,21.36 62.88,22.28 62.86,22.28 62.73,22.41 58.78,22.41 58.38,22.82 55.76,22.82 54.66,23.92 54.66,24.31
XTAL1
  Top 0.406: IC1.30 42.93,21.85 43.37,21.42
  Top 0.61: 43.37,21.42 45.27,19.51 47.73,19.51 49.79,17.46 49.79,13.8 Q1.1
  Top 0.813: Q1.1 C1.2
XTAL2
  Top 0.406: IC1.31 43.73,22.63 44.94,21.42
  Top 0.61: 44.94,21.42 45.63,20.73 48.65,20.73 51.84,17.55 53.22,16.16 54.8,14.59 54.8,13.57 Q1.2
  Top 0.813: Q1.2 C2.2
(copper drawn outside any net)
  shapes: Bottom area x4653

### Text on the board
Bottom: D:/IMAGENES/udplogo1.bmp | D:/IMAGENES/udplogo1.bmp | D:/IMAGENES/udplogo1.bmp | DAQ USB-HID
tPlace: DAQ | 2015 | USB-HID
tNames: - | D:/IMAGENES/UDP MICROCHIP.bmp